# Altium project SoM BaseBoard Prototype V0.PrjPcb
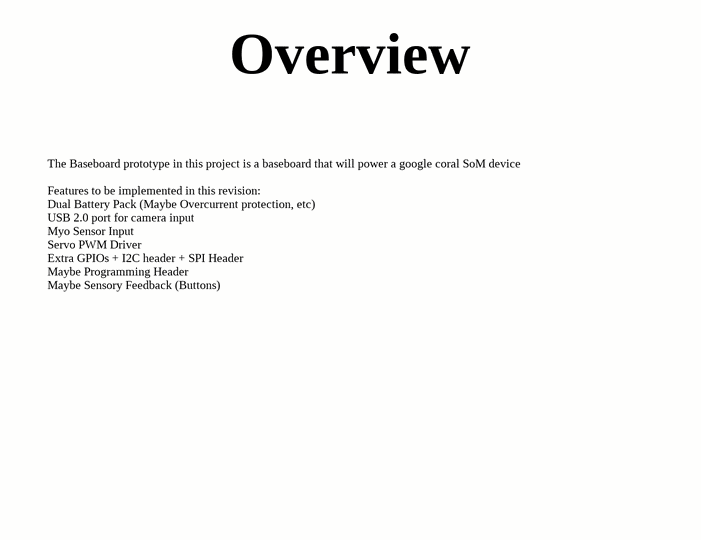
[diagram p0: Overview.SchDoc]
6 sheets, 82 parts. Net scope: flat (ports and power ports of the same name join across sheets).
Board file: SoM BaseBoard Limbotics Prototype V0PcbDoc.PcbDoc
Sheets:
  Overview.SchDoc
  SoM.SchDoc
  Power.SchDoc
  Peripherals - USB.SchDoc
  Peripherals - MyoSensor.SchDoc
  Peripherals - Servos.SchDoc

## Sheet Overview.SchDoc
size 420 x 297 mm; SheetNumber: 1; SheetTotal: 6

### Notes on the sheet
- Overview
- The Baseboard prototype in this project is a baseboard that will power a google coral SoM device
  Features to be implemented in this revision:
  Dual Battery Pack (Maybe Overcurrent protection, etc)
  USB 2.0 port for camera input
  Myo Sensor Input
  Servo PWM Driver
  Extra GPIOs + I2C header + SPI Header
  Maybe Programming Header
  Maybe Sensory Feedback (Buttons)
- THIS DOCUMENT AND THE DATA DISCLOSED HEREIN OR
- HEREWITH IS THE PROPERTY OF ALTIUM LIMITED AND MAY
- DWG NO:
- REVISION
- REV:
- DESCRIPTION
- DATE
- APPROVED
- BE FREELY DISTRIBUTED IN WHOLE. NO RIGHTS ARE
- RESERVED OR EXPRESS OR IMPLIED WARANTEE GIVEN.
- ENG:
- APPROVALS
- PROJECT
- DSN:
- CHK:
- REFERENCE DOCUMENTS
- PROJECT REVISION:
- TITLE
- DOCUMENT REVISION:
- DESIGN ITEM:
- BOM:
- FAB DWG:
- PCB DWG:
- ASSY DWG:
- SCALE:
- A3
- SIZE
- CAGE CODE
- FILE NAME
- DWG NO.
- SHEET
- OF
- REV

## Sheet SoM.SchDoc
size 420 x 297 mm; SheetNumber: 2; SheetTotal: 6
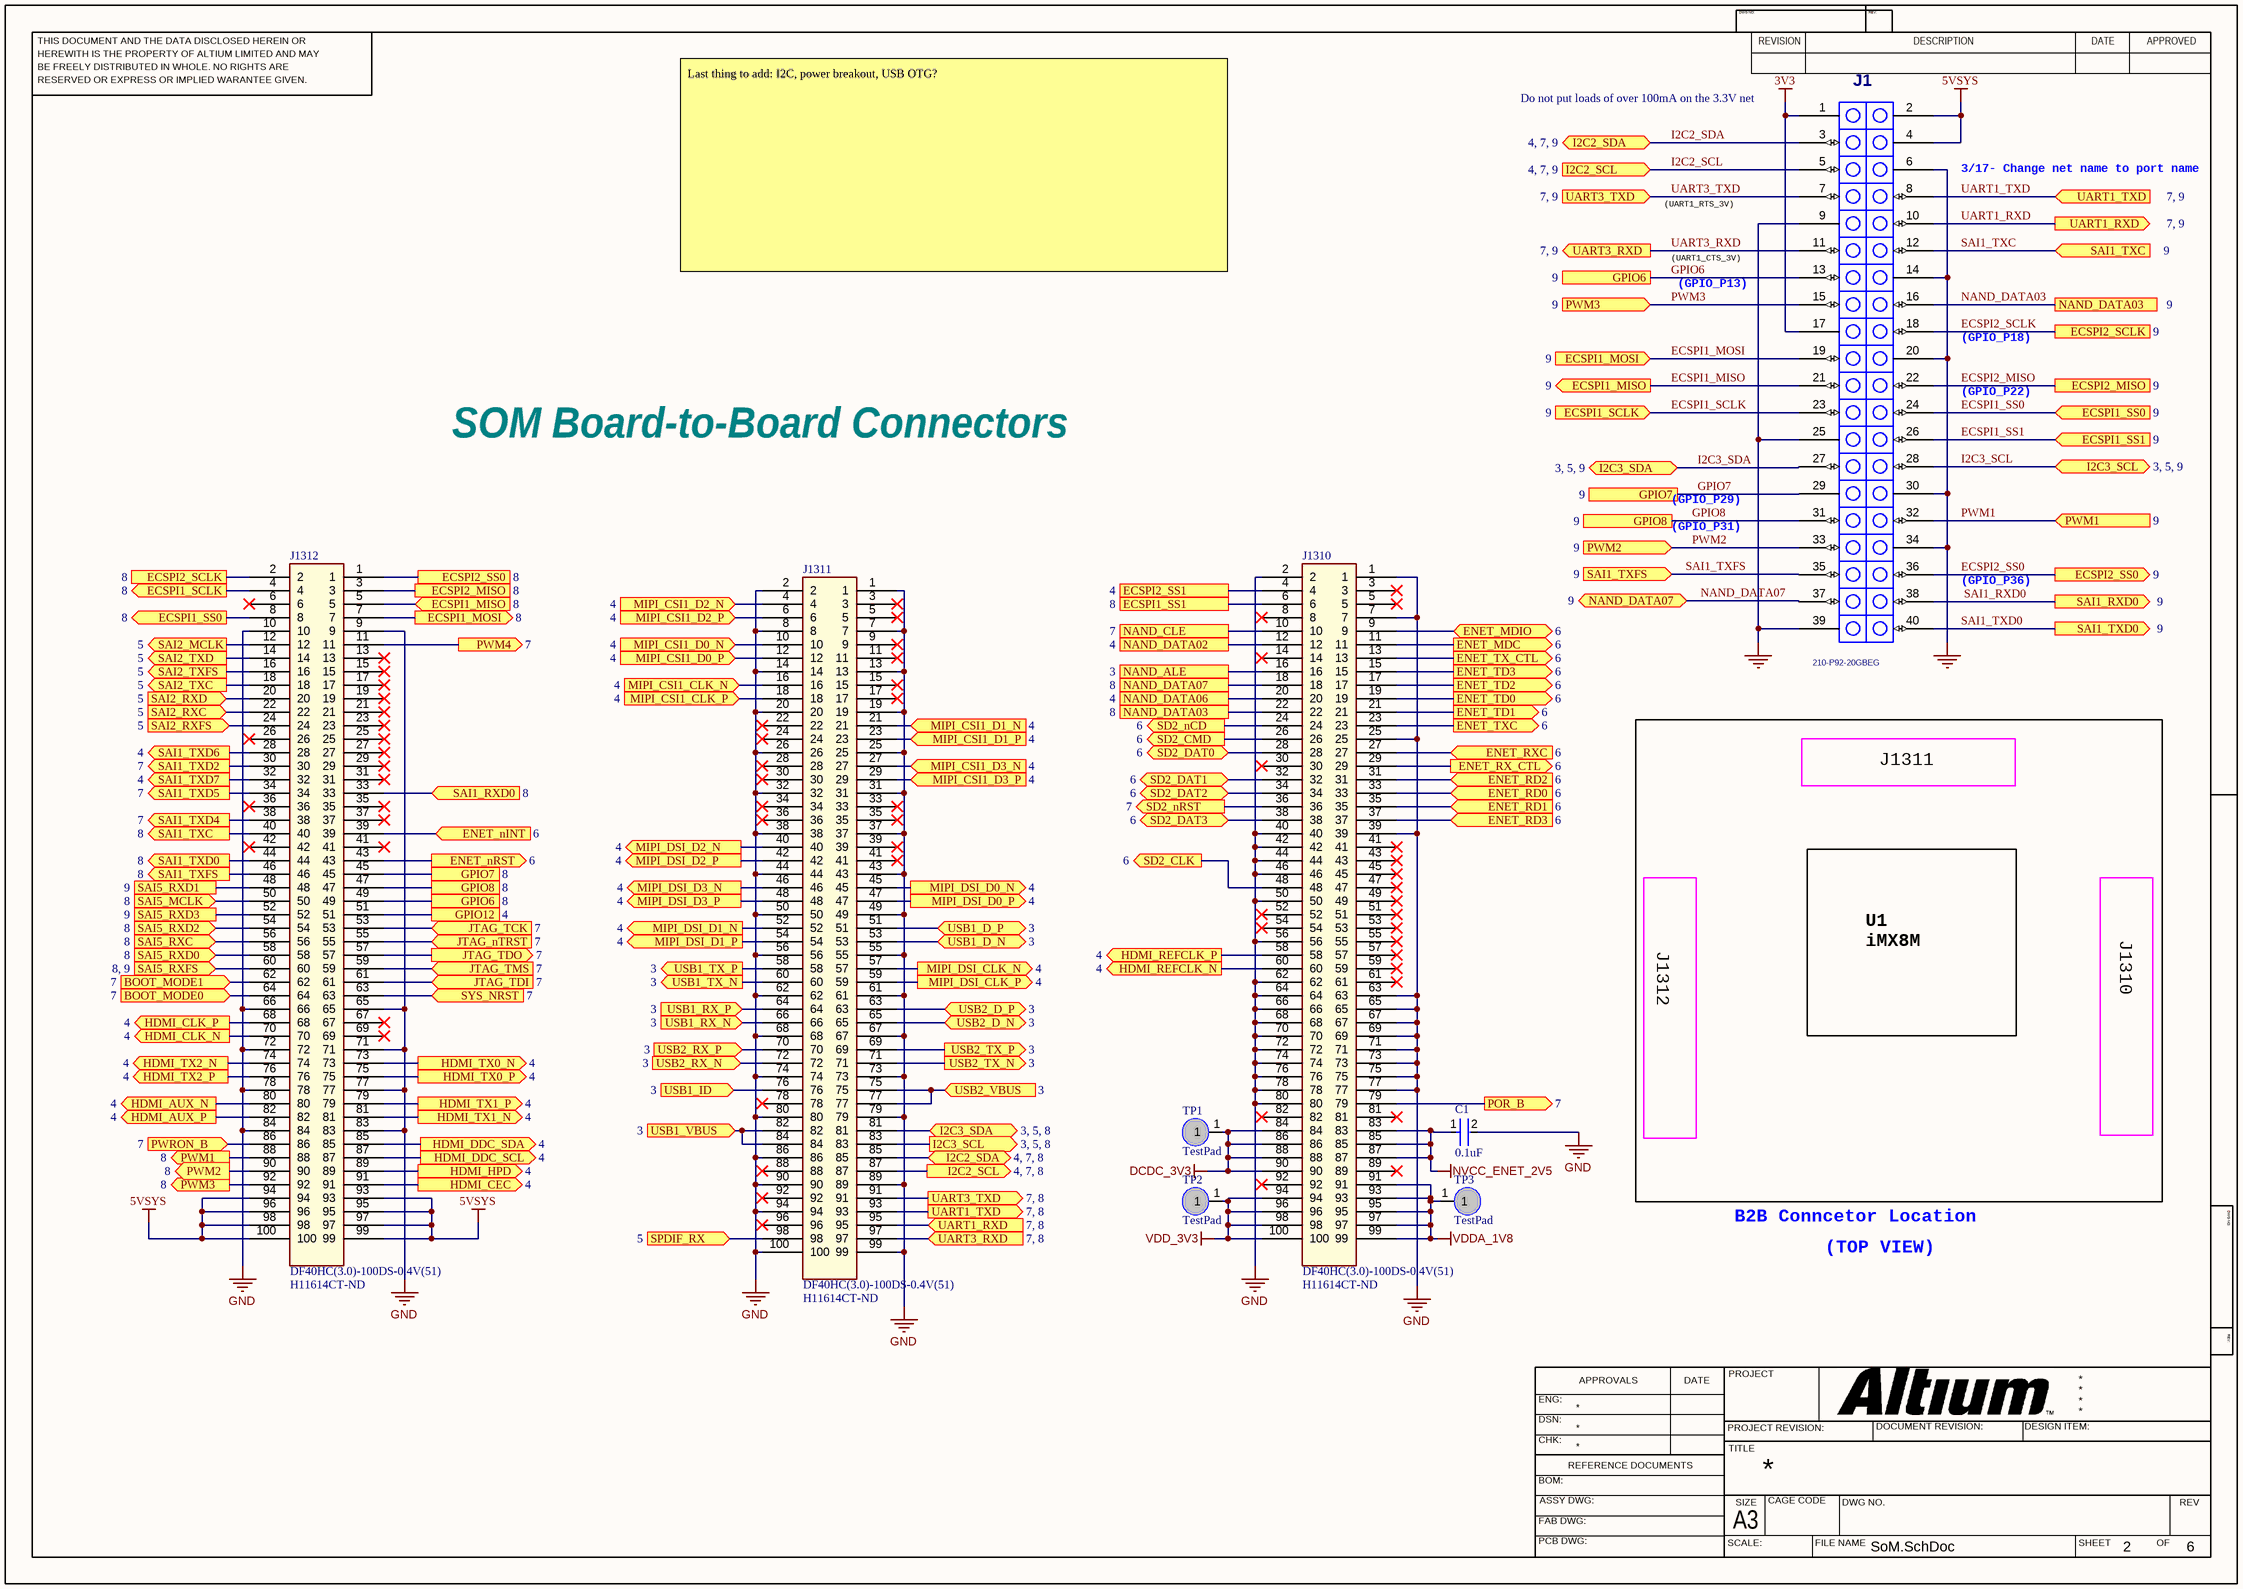
[diagram p1: SoM.SchDoc]

### Parts
C1  0.1uF  [FP-C0603-CJ-MFG]
J1  210-P92-20GBEG  [2X20]
J1310  DF40HC(3.0)-100DS-0.4V(51)  Supplier Part Number 1: H11614CT-ND  [DF40HC30100DS04V51]
J1311  DF40HC(3.0)-100DS-0.4V(51)  Supplier Part Number 1: H11614CT-ND  [DF40HC30100DS04V51]
J1312  DF40HC(3.0)-100DS-0.4V(51)  Supplier Part Number 1: H11614CT-ND  [DF40HC30100DS04V51]
TP1  TestPad  [TestPad50mil]
TP2  TestPad  [TestPad50mil]
TP3  TestPad  [TestPad50mil]

### Ports
BOOT_MODE0 (in, see 7), BOOT_MODE1 (in, see 7), ECSPI1_MISO (in, see 8), ECSPI1_MISO (out, see 9), ECSPI1_MOSI (in, see 9), ECSPI1_MOSI (out, see 8), ECSPI1_SCLK (in, see 9), ECSPI1_SCLK (out, see 8), ECSPI1_SS0 (in, see 9), ECSPI1_SS0 (out, see 8), ECSPI1_SS1 (in, see 9), ECSPI1_SS1 (see 8), ECSPI2_MISO (see 8), ECSPI2_MISO (see 9), ECSPI2_SCLK (see 8), ECSPI2_SCLK (see 9), ECSPI2_SS0 (out, see 9), ECSPI2_SS0 (see 8), ECSPI2_SS1 (see 4), ENET_MDC (out, see 6), ENET_MDIO (bidir, see 6), ENET_nINT (in, see 6), ENET_nRST (out, see 6), ENET_RD0 (in, see 6), ENET_RD1 (in, see 6), ENET_RD2 (in, see 6), ENET_RD3 (in, see 6), ENET_RX_CTL (out, see 6), ENET_RXC (in, see 6), ENET_TD0 (out, see 6), ENET_TD1 (out, see 6), ENET_TD2 (out, see 6), ENET_TD3 (out, see 6), ENET_TX_CTL (out, see 6), ENET_TXC (out, see 6), GPIO6 (see 8), GPIO6 (see 9), GPIO7 (see 8), GPIO7 (see 9), GPIO8 (see 8), GPIO8 (see 9), GPIO12 (see 4), HDMI_AUX_N (out, see 4), HDMI_AUX_P (out, see 4), HDMI_CEC (out, see 4), HDMI_CLK_N (out, see 4), HDMI_CLK_P (out, see 4), HDMI_DDC_SCL (out, see 4), HDMI_DDC_SDA (out, see 4), HDMI_HPD (out, see 4), HDMI_REFCLK_N (out, see 4), HDMI_REFCLK_P (out, see 4), HDMI_TX0_N (out, see 4), HDMI_TX0_P (out, see 4), HDMI_TX1_N (out, see 4), HDMI_TX1_P (out, see 4), HDMI_TX2_N (out, see 4), HDMI_TX2_P (out, see 4), I2C2_SCL (in, see 4, 7, 9), I2C2_SCL (out, see 4, 7, 8), I2C2_SDA (bidir, see 4, 7, 8), I2C2_SDA (bidir, see 4, 7, 9), I2C3_SCL (bidir, see 3, 5, 9), I2C3_SCL (out, see 3, 5, 8), I2C3_SDA (bidir, see 3, 5, 8), I2C3_SDA (bidir, see 3, 5, 9), JTAG_nTRST (in, see 7), JTAG_TCK (in, see 7), JTAG_TDI (in, see 7), JTAG_TDO (out, see 7), JTAG_TMS (in, see 7), MIPI_CSI1_CLK_N (in, see 4), MIPI_CSI1_CLK_P (in, see 4), MIPI_CSI1_D0_N (in, see 4), MIPI_CSI1_D0_P (in, see 4), MIPI_CSI1_D1_N (in, see 4), MIPI_CSI1_D1_P (in, see 4), MIPI_CSI1_D2_N (in, see 4), MIPI_CSI1_D2_P (in, see 4), MIPI_CSI1_D3_N (in, see 4), MIPI_CSI1_D3_P (in, see 4), MIPI_DSI_CLK_N (out, see 4), MIPI_DSI_CLK_P (out, see 4), MIPI_DSI_D0_N (out, see 4), MIPI_DSI_D0_P (out, see 4), MIPI_DSI_D1_N (out, see 4), MIPI_DSI_D1_P (out, see 4), MIPI_DSI_D2_N (out, see 4), MIPI_DSI_D2_P (out, see 4), MIPI_DSI_D3_N (out, see 4), MIPI_DSI_D3_P (out, see 4), NAND_ALE (see 3), NAND_CLE (see 7), NAND_DATA02 (see 4), NAND_DATA03 (see 8), NAND_DATA03 (see 9), NAND_DATA06 (see 4), NAND_DATA07 (bidir, see 9), NAND_DATA07 (see 8), POR_B (out, see 7), PWM1 (in, see 9), PWM1 (out, see 8), PWM2 (in, see 9), PWM2 (out, see 8), PWM3 (in, see 9), PWM3 (out, see 8), PWM4 (out, see 7), PWRON_B (in, see 7), SAI1_RXD0 (in, see 8), SAI1_RXD0 (out, see 9), SAI1_TXC (in, see 9), SAI1_TXC (out, see 8), SAI1_TXD0 (out, see 8), SAI1_TXD0 (out, see 9), SAI1_TXD2 (out, see 7), SAI1_TXD4 (out, see 7), SAI1_TXD5 (out, see 7), SAI1_TXD6 (out, see 4), SAI1_TXD7 (out, see 4), SAI1_TXFS (in, see 9), SAI1_TXFS (out, see 8), SAI2_MCLK (out, see 5), SAI2_RXC (in, see 5), SAI2_RXD (in, see 5), SAI2_RXFS (in, see 5), SAI2_TXC (out, see 5), SAI2_TXD (out, see 5), SAI2_TXFS (out, see 5), SAI5_MCLK (in, see 8), SAI5_RXC (in, see 8), SAI5_RXD0 (in, see 8), SAI5_RXD1 (see 9), SAI5_RXD2 (in, see 8), SAI5_RXD3 (see 9), SAI5_RXFS (in, see 8, 9), SD2_CLK (out, see 6), SD2_CMD (out, see 6), SD2_DAT0 (bidir, see 6), SD2_DAT1 (bidir, see 6), SD2_DAT2 (bidir, see 6), SD2_DAT3 (bidir, see 6), SD2_nCD (out, see 6), SD2_nRST (out, see 7), SPDIF_RX (in, see 5), SYS_NRST (in, see 7), UART1_RXD (in, see 7, 8), UART1_RXD (out, see 7, 9), UART1_TXD (in, see 7, 9), UART1_TXD (out, see 7, 8), UART3_RXD (in, see 7, 8), UART3_RXD (out, see 7, 9), UART3_TXD (in, see 7, 9), UART3_TXD (out, see 7, 8), USB1_D_N (bidir, see 3), USB1_D_P (bidir, see 3), USB1_ID (in, see 3), USB1_RX_N (in, see 3), USB1_RX_P (in, see 3), USB1_TX_N (out, see 3), USB1_TX_P (out, see 3), USB1_VBUS (in, see 3), USB2_D_N (bidir, see 3), USB2_D_P (bidir, see 3), USB2_RX_N (in, see 3), USB2_RX_P (in, see 3), USB2_TX_N (out, see 3), USB2_TX_P (out, see 3), USB2_VBUS (in, see 3)

### Nets
3V3: J1.1 J1.17
5VSYS: J1.2 J1.4 J1312.93 J1312.94 J1312.95 J1312.96 J1312.97 J1312.98 J1312.99 J1312.100
DCDC_3V3: J1310.84 J1310.86 J1310.88 J1310.90 TP1.1
GND: C1.2 J1.6 J1.9 J1.14 J1.20 J1.25 J1.30 J1.34 J1.39 J1310.1 J1310.2 J1310.7 J1310.25 J1310.39 J1310.40 J1310.42 J1310.44 J1310.46 J1310.50 J1310.56 J1310.62 J1310.63 J1310.64 J1310.65 J1310.66 J1310.67 J1310.68 J1310.69 J1310.70 J1310.71 J1310.72 J1310.73 J1310.74 J1310.75 J1310.76 J1310.77 J1310.78 J1310.80 J1311.1 J1311.2 J1311.7 J1311.8 J1311.13 J1311.14 J1311.19 J1311.20 J1311.25 J1311.26 J1311.31 J1311.32 J1311.37 J1311.38 J1311.43 J1311.44 J1311.49 J1311.50 J1311.55 J1311.56 J1311.61 J1311.62 J1311.67 J1311.68 J1311.73 J1311.74 J1311.79 J1311.80 J1311.86 J1311.89 J1311.90 J1311.94 J1311.99 J1311.100 J1312.9 J1312.10 J1312.65 J1312.66 J1312.71 J1312.72 J1312.77 J1312.78 J1312.83 J1312.84
NVCC_ENET_2V5: C1.1 J1310.83 J1310.85 J1310.87
VDD_3V3: J1310.94 J1310.96 J1310.98 J1310.100 TP2.1
VDDA_1V8: J1310.91 J1310.93 J1310.95 J1310.97 J1310.99 TP3.1
ECSPI1_MISO: J1.21 J1312.5 ; port ECSPI1_MISO
ECSPI1_MOSI: J1.19 J1312.7 ; port ECSPI1_MOSI
ECSPI1_SCLK: J1.23 J1312.4 ; port ECSPI1_SCLK
ECSPI1_SS0: J1.24 J1312.8 ; port ECSPI1_SS0
ECSPI1_SS1: J1.26 J1310.6 ; port ECSPI1_SS1
ECSPI2_MISO: J1.22 J1312.3 ; port ECSPI2_MISO
ECSPI2_SCLK: J1.18 J1312.2 ; port ECSPI2_SCLK
ECSPI2_SS0: J1.36 J1312.1 ; port ECSPI2_SS0
GPIO6: J1.13 J1312.49 ; port GPIO6
GPIO7: J1.29 J1312.45 ; port GPIO7
GPIO8: J1.31 J1312.47 ; port GPIO8
I2C2_SCL: J1.5 J1311.87 ; port I2C2_SCL
I2C2_SDA: J1.3 J1311.85 ; port I2C2_SDA
I2C3_SCL: J1.28 J1311.83 ; port I2C3_SCL
I2C3_SDA: J1.27 J1311.81 ; port I2C3_SDA
NAND_DATA03: J1.16 J1310.22 ; port NAND_DATA03
NAND_DATA07: J1.37 J1310.18 ; port NAND_DATA07
PWM1: J1.32 J1312.88 ; port PWM1
PWM2: J1.33 J1312.90 ; port PWM2
PWM3: J1.15 J1312.92 ; port PWM3
PWM4: J1312.11 ; port PWM4
SAI1_RXD0: J1.38 J1312.33 ; port SAI1_RXD0
SAI1_TXC: J1.12 J1312.40 ; port SAI1_TXC
SAI1_TXD0: J1.40 J1312.44 ; port SAI1_TXD0
SAI1_TXFS: J1.35 J1312.46 ; port SAI1_TXFS
UART1_RXD: J1.10 J1311.95 ; port UART1_RXD
UART1_TXD: J1.8 J1311.93 ; port UART1_TXD
UART3_RXD: J1.11 J1311.97 ; port UART3_RXD
UART3_TXD: J1.7 J1311.91 ; port UART3_TXD
NetJ4_2: J1311.65 ; port USB2_D_N
NetJ4_3: J1311.63 ; port USB2_D_P
NetJ1310_4: J1310.4 ; port ECSPI2_SS1
NetJ1310_9: J1310.9 ; port ENET_MDIO
NetJ1310_10: J1310.10 ; port NAND_CLE
NetJ1310_11: J1310.11 ; port ENET_MDC
NetJ1310_12: J1310.12 ; port NAND_DATA02
NetJ1310_13: J1310.13 ; port ENET_TX_CTL
NetJ1310_15: J1310.15 ; port ENET_TD3
NetJ1310_16: J1310.16 ; port NAND_ALE
NetJ1310_17: J1310.17 ; port ENET_TD2
NetJ1310_19: J1310.19 ; port ENET_TD0
NetJ1310_20: J1310.20 ; port NAND_DATA06
NetJ1310_21: J1310.21 ; port ENET_TD1
NetJ1310_23: J1310.23 ; port ENET_TXC
NetJ1310_24: J1310.24 ; port SD2_nCD
NetJ1310_26: J1310.26 ; port SD2_CMD
NetJ1310_27: J1310.27 ; port ENET_RXC
NetJ1310_28: J1310.28 ; port SD2_DAT0
NetJ1310_29: J1310.29 ; port ENET_RX_CTL
NetJ1310_31: J1310.31 ; port ENET_RD2
NetJ1310_32: J1310.32 ; port SD2_DAT1
NetJ1310_33: J1310.33 ; port ENET_RD0
NetJ1310_34: J1310.34 ; port SD2_DAT2
NetJ1310_35: J1310.35 ; port ENET_RD1
NetJ1310_36: J1310.36 ; port SD2_nRST
NetJ1310_37: J1310.37 ; port ENET_RD3
NetJ1310_38: J1310.38 ; port SD2_DAT3
NetJ1310_48: J1310.48 ; port SD2_CLK
NetJ1310_58: J1310.58 ; port HDMI_REFCLK_P
NetJ1310_60: J1310.60 ; port HDMI_REFCLK_N
NetJ1310_79: J1310.79 ; port POR_B
NetJ1311_4: J1311.4 ; port MIPI_CSI1_D2_N
NetJ1311_6: J1311.6 ; port MIPI_CSI1_D2_P
NetJ1311_10: J1311.10 ; port MIPI_CSI1_D0_N
NetJ1311_12: J1311.12 ; port MIPI_CSI1_D0_P
NetJ1311_16: J1311.16 ; port MIPI_CSI1_CLK_N
NetJ1311_18: J1311.18 ; port MIPI_CSI1_CLK_P
NetJ1311_21: J1311.21 ; port MIPI_CSI1_D1_N
NetJ1311_23: J1311.23 ; port MIPI_CSI1_D1_P
NetJ1311_27: J1311.27 ; port MIPI_CSI1_D3_N
NetJ1311_29: J1311.29 ; port MIPI_CSI1_D3_P
NetJ1311_40: J1311.40 ; port MIPI_DSI_D2_N
NetJ1311_42: J1311.42 ; port MIPI_DSI_D2_P
NetJ1311_45: J1311.45 ; port MIPI_DSI_D0_N
NetJ1311_46: J1311.46 ; port MIPI_DSI_D3_N
NetJ1311_47: J1311.47 ; port MIPI_DSI_D0_P
NetJ1311_48: J1311.48 ; port MIPI_DSI_D3_P
NetJ1311_51: J1311.51 ; port USB1_D_P
NetJ1311_52: J1311.52 ; port MIPI_DSI_D1_N
NetJ1311_53: J1311.53 ; port USB1_D_N
NetJ1311_54: J1311.54 ; port MIPI_DSI_D1_P
NetJ1311_57: J1311.57 ; port MIPI_DSI_CLK_N
NetJ1311_58: J1311.58 ; port USB1_TX_P
NetJ1311_59: J1311.59 ; port MIPI_DSI_CLK_P
NetJ1311_60: J1311.60 ; port USB1_TX_N
NetJ1311_64: J1311.64 ; port USB1_RX_P
NetJ1311_66: J1311.66 ; port USB1_RX_N
NetJ1311_69: J1311.69 ; port USB2_TX_P
NetJ1311_70: J1311.70 ; port USB2_RX_P
NetJ1311_71: J1311.71 ; port USB2_TX_N
NetJ1311_72: J1311.72 ; port USB2_RX_N
NetJ1311_75: J1311.75 J1311.77 ; port USB2_VBUS
NetJ1311_76: J1311.76 ; port USB1_ID
NetJ1311_82: J1311.82 J1311.84 ; port USB1_VBUS
NetJ1311_98: J1311.98 ; port SPDIF_RX
NetJ1312_12: J1312.12 ; port SAI2_MCLK
NetJ1312_14: J1312.14 ; port SAI2_TXD
NetJ1312_16: J1312.16 ; port SAI2_TXFS
NetJ1312_18: J1312.18 ; port SAI2_TXC
NetJ1312_20: J1312.20 ; port SAI2_RXD
NetJ1312_22: J1312.22 ; port SAI2_RXC
NetJ1312_24: J1312.24 ; port SAI2_RXFS
NetJ1312_28: J1312.28 ; port SAI1_TXD6
NetJ1312_30: J1312.30 ; port SAI1_TXD2
NetJ1312_32: J1312.32 ; port SAI1_TXD7
NetJ1312_34: J1312.34 ; port SAI1_TXD5
NetJ1312_38: J1312.38 ; port SAI1_TXD4
NetJ1312_39: J1312.39 ; port ENET_nINT
NetJ1312_43: J1312.43 ; port ENET_nRST
NetJ1312_48: J1312.48 ; port SAI5_RXD1
NetJ1312_50: J1312.50 ; port SAI5_MCLK
NetJ1312_51: J1312.51 ; port GPIO12
NetJ1312_52: J1312.52 ; port SAI5_RXD3
NetJ1312_53: J1312.53 ; port JTAG_TCK
NetJ1312_54: J1312.54 ; port SAI5_RXD2
NetJ1312_55: J1312.55 ; port JTAG_nTRST
NetJ1312_56: J1312.56 ; port SAI5_RXC
NetJ1312_57: J1312.57 ; port JTAG_TDO
NetJ1312_58: J1312.58 ; port SAI5_RXD0
NetJ1312_59: J1312.59 ; port JTAG_TMS
NetJ1312_60: J1312.60 ; port SAI5_RXFS
NetJ1312_61: J1312.61 ; port JTAG_TDI
NetJ1312_62: J1312.62 ; port BOOT_MODE1
NetJ1312_63: J1312.63 ; port SYS_NRST
NetJ1312_64: J1312.64 ; port BOOT_MODE0
NetJ1312_68: J1312.68 ; port HDMI_CLK_P
NetJ1312_70: J1312.70 ; port HDMI_CLK_N
NetJ1312_73: J1312.73 ; port HDMI_TX0_N
NetJ1312_74: J1312.74 ; port HDMI_TX2_N
NetJ1312_75: J1312.75 ; port HDMI_TX0_P
NetJ1312_76: J1312.76 ; port HDMI_TX2_P
NetJ1312_79: J1312.79 ; port HDMI_TX1_P
NetJ1312_80: J1312.80 ; port HDMI_AUX_N
NetJ1312_81: J1312.81 ; port HDMI_TX1_N
NetJ1312_82: J1312.82 ; port HDMI_AUX_P
NetJ1312_85: J1312.85 ; port HDMI_DDC_SDA
NetJ1312_86: J1312.86 ; port PWRON_B
NetJ1312_87: J1312.87 ; port HDMI_DDC_SCL
NetJ1312_89: J1312.89 ; port HDMI_HPD
NetJ1312_91: J1312.91 ; port HDMI_CEC

Not connected (* = marked no-connect by the designer): J1310 3* 5* 8* 14* 30* 41* 43* 45* 47* 49* 51* 52* 53* 54* 55* 57* 59* 61* 81* 82* 89* 92*; J1311 3* 5* 9* 11* 15* 17* 22* 24* 28* 30* 33* 34* 35* 36* 39* 41* 78* 88* 92* 96*; J1312 6* 13* 15* 17* 19* 21* 23* 25* 26* 27* 29* 31* 35* 36* 37* 41* 42* 67* 69*

### Notes on the sheet
- (near J1) Do not put loads of over 100mA on the 3.3V net
- 3/17- Change net name to port name
- (UART1_RTS_3V)
- (UART1_CTS_3V)
- Last thing to add: I2C, power breakout, USB OTG?
- (GPIO_P13)
- (GPIO_P18)
- (GPIO_P22)
- SOM Board-to-Board Connectors
- (GPIO_P31)
- (GPIO_P29)
- (GPIO_P36)
- J1311
- J1310
- J1312
- U1
  iMX8M
- B2B Conncetor Location
- (TOP VIEW)
- THIS DOCUMENT AND THE DATA DISCLOSED HEREIN OR
- HEREWITH IS THE PROPERTY OF ALTIUM LIMITED AND MAY
- DWG NO:
- REVISION
- REV:
- DESCRIPTION
- DATE
- APPROVED
- BE FREELY DISTRIBUTED IN WHOLE. NO RIGHTS ARE
- RESERVED OR EXPRESS OR IMPLIED WARANTEE GIVEN.
- ENG:
- APPROVALS
- PROJECT
- DSN:
- CHK:
- REFERENCE DOCUMENTS
- PROJECT REVISION:
- TITLE
- DOCUMENT REVISION:
- DESIGN ITEM:
- BOM:
- FAB DWG:
- PCB DWG:
- ASSY DWG:
- SCALE:
- A3
- SIZE
- CAGE CODE
- FILE NAME
- DWG NO.
- SHEET
- OF
- REV

### Library data of the parts
C1 = CMP-2006-03300-2: C0603X104K5RACTU CAP CER 0.1UF 50V X7R 0603; Manufacturer: Kemet; Description: Ceramic Chip Capacitor 0.1µF ±10% 50V; Capacitance: 100nF; Material: Ceramic; Tolerance: 10%; Value: 100nF; Temperature Coefficient: 15%; Temperature Range High: +125°C; Temperature Range Low: -55°C; Manufacturer Part Number: C0603X104K5RACTU; Voltage: 50V; ComponentLink2Description: Datasheet; RoHS: TRUE; ComponentLink2URL: https://content.kemet.com/datasheets/KEM_C1013_X7R_FT-CAP_SMD.pdf; Device Class L3: Ceramic Capacitors; Device Class L2: Capacitors; Package: C0603-CJ; Height: 0.95mm; Device Class L1: Passive Components; Temperature Characteristic: X7R; Lead Free: Yes; Digikey Description: CAP CER 0.1UF 50V X7R 0603; Automotive: No; Mouser Description: Capacitor; Ceramic; Cap 0.1uF; Tol+10%; SMT; Flexible Termination; Vol-Rtg 50V; TR; Temperature: -55°C to +125°C; Octopart: https://octopart.com/c0603x104k5ractu-kemet-9145062; Category: Cap; Voltage Rating: 50V; Ipc Land Pattern Name: CAPC16080X80
J1 = CONN_HEADER_20x2_SMT: SOCKET 2X20 100-MIL STRAIGHT SMT; Function Code: DOK; QPN: DFHD20MS161; QPN Description: CONN DIP HEADER 20P 2R MS(P2.54,H8.3); Supplier 1: Samtec; Supplier Part Number 1: 210-P92-20GBEG; MPN: 210-P92-20GBEG; QCI MPN: 210-P92-20GBEG; QCI Supplier: PRX
J1310-J1312 = CONN_HIROSE-DF40C-100DP-0.4V(51): CONN HDR 100POS 0.4MM SMD GOLD; Function Code: DOK; QPN: DFHSA0FR017; QPN Description: CONN HOUSING 100P 2R FR(P0.4,H2.9); QCI Supplier: HRS; Supplier 1: Digi-Key; MPN: DF40HC(3.0)-100DS-0.4V(51); QCI MPN: DF40HC(3.0)-100DS-0.4V(51)

## Sheet Power.SchDoc
size 420 x 297 mm; SheetNumber: 3; SheetTotal: 6
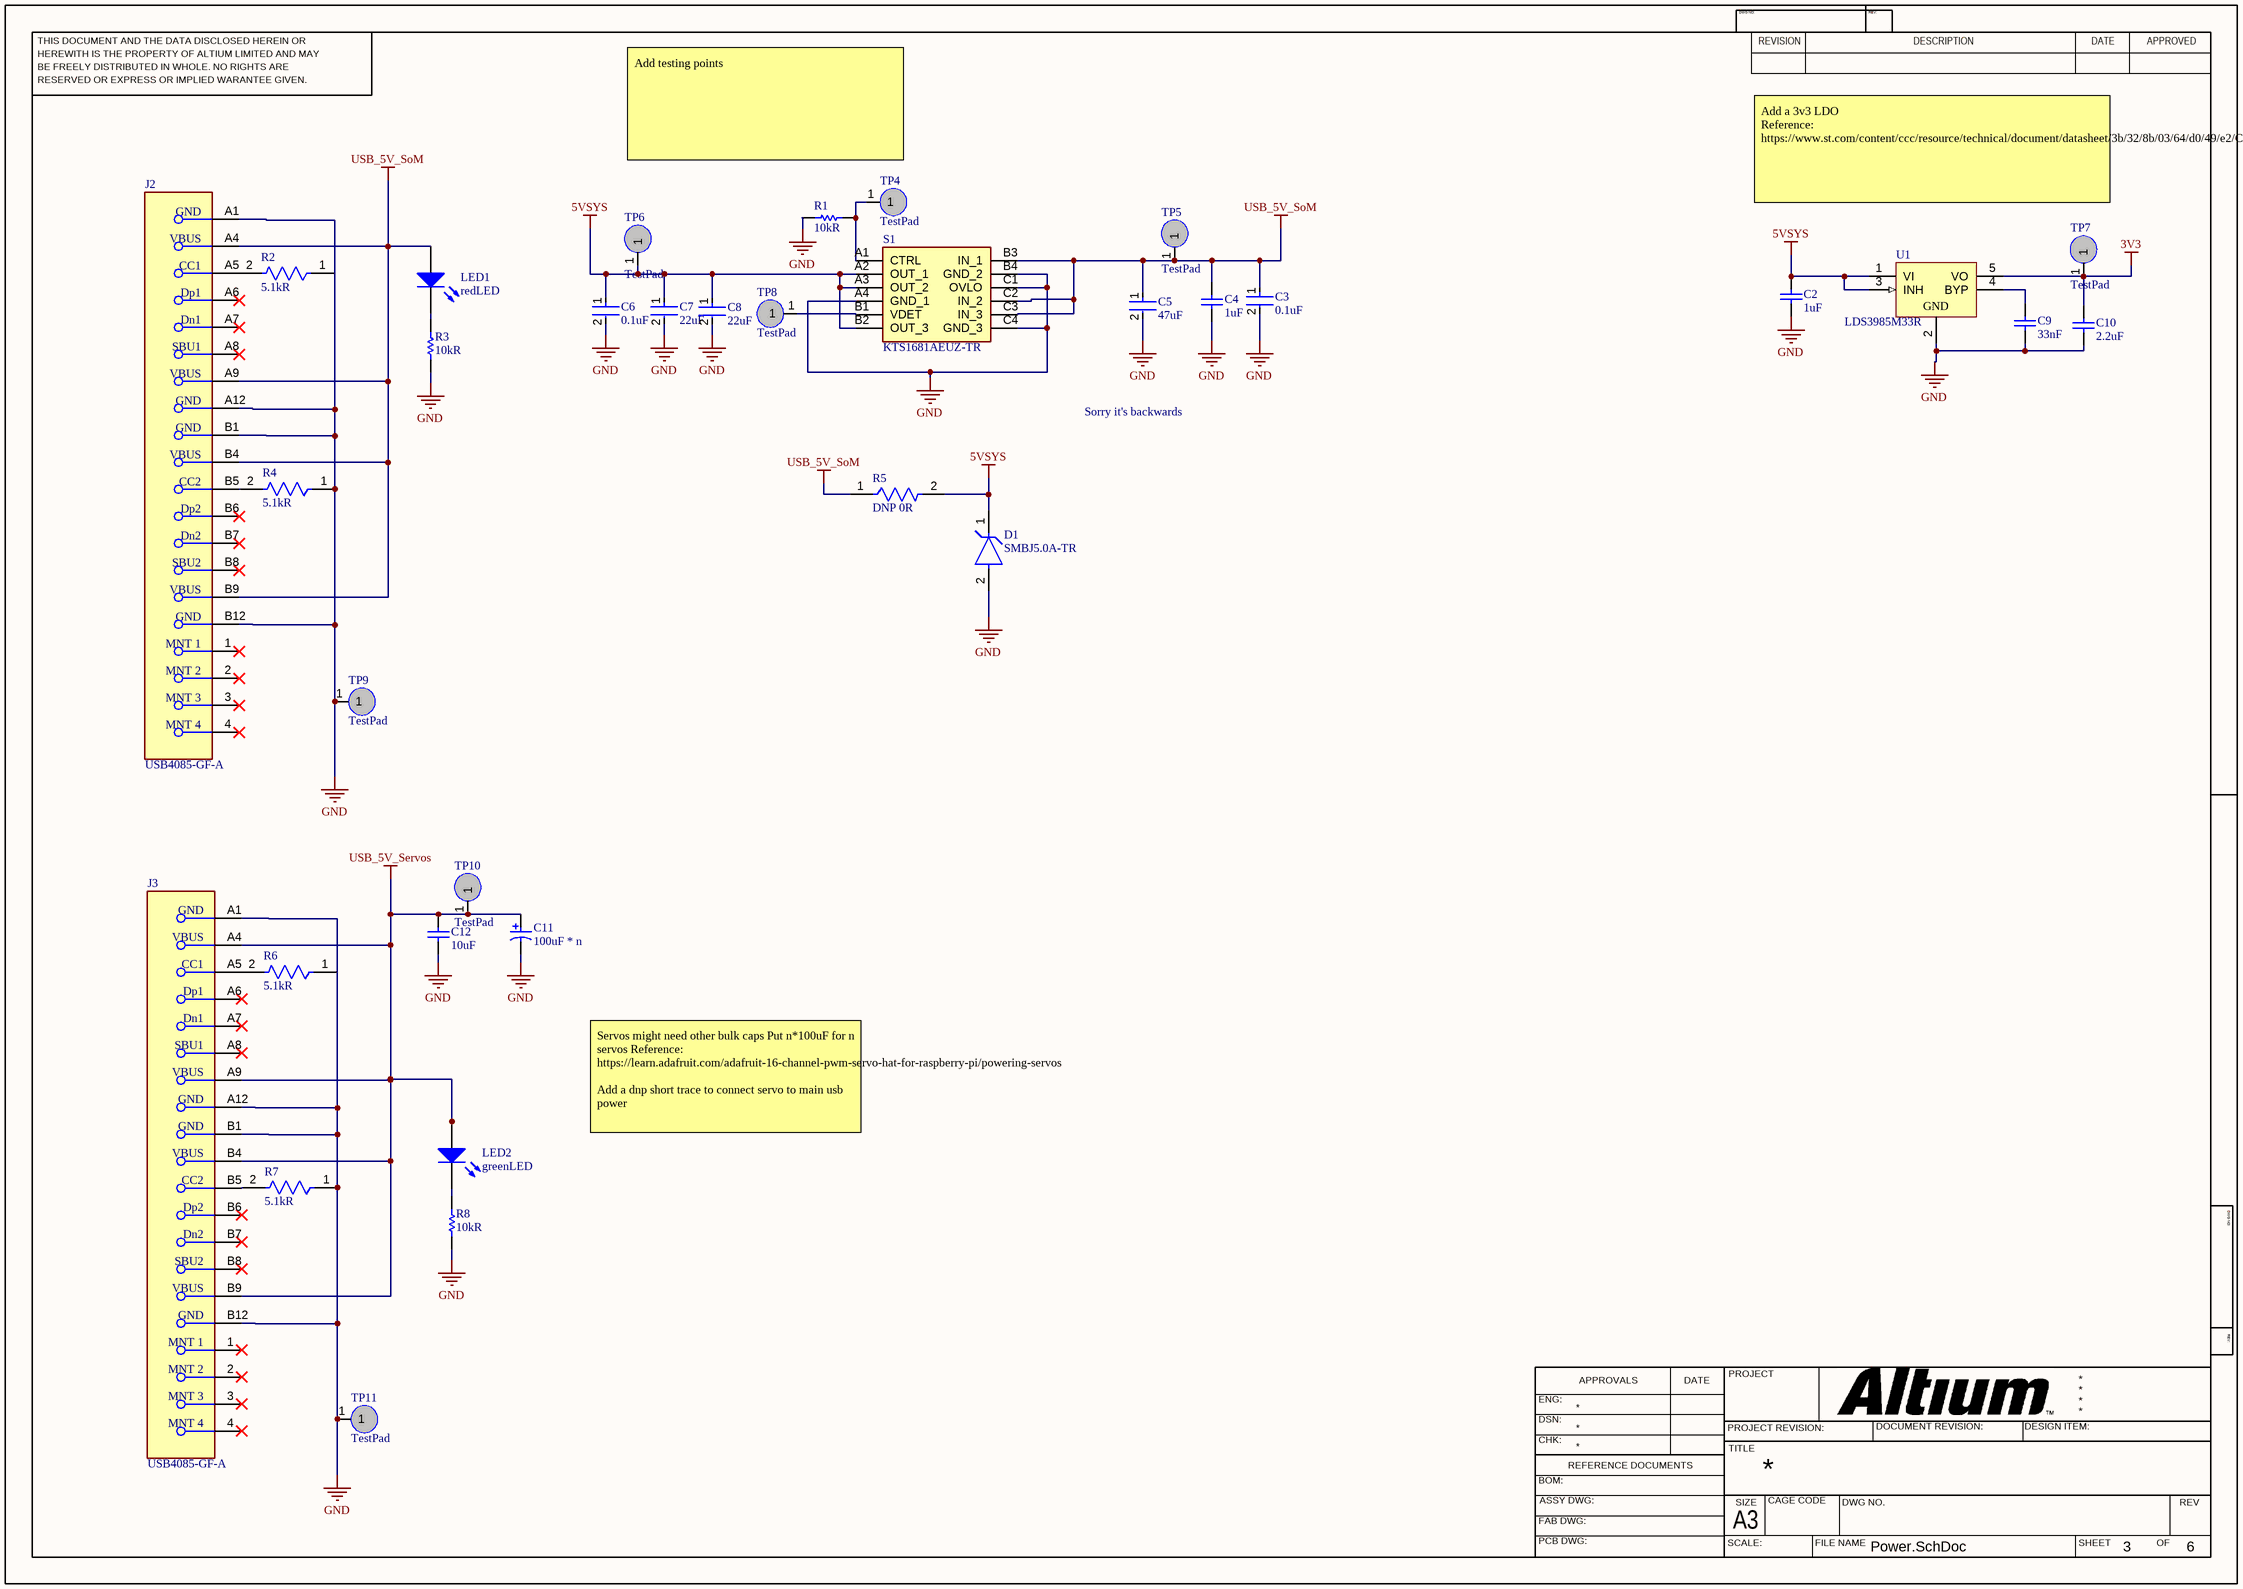
[diagram p2: Power.SchDoc]

### Parts
C2  1uF  [CAPC2013X145X50LL20T25]
C3  0.1uF  [FP-C0603-CJ-MFG]
C4  1uF  [CAPC2013X145X50LL20T25]
C5  47uF  [FP-GRM31C-0_2-e0_3_0_8-IPC_C]
C6  0.1uF  [FP-C0603-CJ-MFG]
C7  22uF  [FP-GRM21B-0_15-MFG]
C8  22uF  [FP-GRM21B-0_15-MFG]
C9  33nF  [CAPC2013X94X50LL20T25]
C10  2.2uF  [CAPC2013X135X50ML10T20]
C11  100uF * n  [CAPPR65-500-2000X1250X2200]
C12  10uF  [CAPC2013X145X20ML20]
D1  SMBJ5.0A-TR  [FP-SMB-MFG]
J2  USB4085-GF-A  [FP-USB4085-GF-A-MFG]
J3  USB4085-GF-A  [FP-USB4085-GF-A-MFG]
LED1  redLED  [0805_A]
LED2  greenLED  [0805_A]
R1  10kR  [RESC2013X60X35NL10T20]
R2  5.1kR  [FP-CRCW0805-e3-MFG]
R3  10kR  [RESC2013X60X35ML10T20]
R4  5.1kR  [FP-CRCW0805-e3-MFG]
R5  DNP 0R  [FP-RC1206-MFG]
R6  5.1kR  [FP-CRCW0805-e3-MFG]
R7  5.1kR  [FP-CRCW0805-e3-MFG]
R8  10kR  [RESC2013X60X35ML10T20]
S1  KTS1681AEUZ-TR  [KTS1681AEUZTR]
TP4  TestPad  [TestPad50mil]
TP5  TestPad  [TestPad50mil]
TP6  TestPad  [TestPad50mil]
TP7  TestPad  [TestPad50mil]
TP8  TestPad  [TestPad50mil]
TP9  TestPad  [TestPad50mil]
TP10  TestPad  [TestPad50mil]
TP11  TestPad  [TestPad50mil]
U1  LDS3985M33R  [SOT23-5L_M]

### Nets
3V3: C10.2 TP7.1 U1.5(VO)
5VSYS: C2.2 C6.1 C7.1 C8.1 D1.1(K) R5.2 S1.A2(OUT_1) S1.A3(OUT_2) S1.B2(OUT_3) TP6.1 U1.1(VI) U1.3(INH)
GND: C2.1 C3.2 C4.1 C5.2 C6.2 C7.2 C8.2 C9.1 C10.1 C11.2 C12.1 D1.2(A) J2.A1(GND) J2.A12(GND) J2.B1(GND) J2.B12(GND) J3.A1(GND) J3.A12(GND) J3.B1(GND) J3.B12(GND) R1.2 R3.1 R4.1 R7.1 R8.1 S1.A4(GND_1) S1.B4(GND_2) S1.C1(OVLO) S1.C4(GND_3) TP9.1 TP11.1 U1.2(GND)
USB_5V_Servos: C11.1 C12.2 J3.A4(VBUS) J3.A9(VBUS) J3.B4(VBUS) J3.B9(VBUS) LED2.2(A) TP10.1
USB_5V_SoM: C3.1 C4.2 C5.1 J2.A4(VBUS) J2.A9(VBUS) J2.B4(VBUS) J2.B9(VBUS) LED1.2(A) R5.1 S1.B3(IN_1) S1.C2(IN_2) S1.C3(IN_3) TP5.1
NetC9_2: C9.2 U1.4(BYP)
NetJ2_A5: J2.A5(CC1) R2.2
NetJ2_B5: J2.B5(CC2) R4.2
NetJ3_A5: J3.A5(CC1) R6.2
NetJ3_B5: J3.B5(CC2) R7.2
NetLED1_1: LED1.1(K) R3.2
NetLED2_1: LED2.1(K) R8.2
NetR1_1: R1.1 S1.A1(CTRL) TP4.1
NetS1_B1: S1.B1(VDET) TP8.1

Not connected (* = marked no-connect by the designer): J2 1(MNT_1)* 2(MNT_2)* 3(MNT_3)* 4(MNT_4)* A6(Dp1)* A7(Dn1)* A8(SBU1)* B6(Dp2)* B7(Dn2)* B8(SBU2)*; J3 1(MNT_1)* 2(MNT_2)* 3(MNT_3)* 4(MNT_4)* A6(Dp1)* A7(Dn1)* A8(SBU1)* B6(Dp2)* B7(Dn2)* B8(SBU2)*; R2 1; R6 1

### Notes on the sheet
- Add testing points
- Add a 3v3 LDO
  Reference: https://www.st.com/content/ccc/resource/technical/document/datasheet/3b/32/8b/03/64/d0/49/e2/CD00047465.pdf/files/CD00047465.pdf/jcr:content/translations/en.CD00047465.pdf
- Sorry it's backwards
- Servos might need other bulk caps Put n*100uF for n servos Reference:
  https://learn.adafruit.com/adafruit-16-channel-pwm-servo-hat-for-raspberry-pi/powering-servos
  Add a dnp short trace to connect servo to main usb power
- THIS DOCUMENT AND THE DATA DISCLOSED HEREIN OR
- HEREWITH IS THE PROPERTY OF ALTIUM LIMITED AND MAY
- DWG NO:
- REVISION
- REV:
- DESCRIPTION
- DATE
- APPROVED
- BE FREELY DISTRIBUTED IN WHOLE. NO RIGHTS ARE
- RESERVED OR EXPRESS OR IMPLIED WARANTEE GIVEN.
- ENG:
- APPROVALS
- PROJECT
- DSN:
- CHK:
- REFERENCE DOCUMENTS
- PROJECT REVISION:
- TITLE
- DOCUMENT REVISION:
- DESIGN ITEM:
- BOM:
- FAB DWG:
- PCB DWG:
- ASSY DWG:
- SCALE:
- A3
- SIZE
- CAGE CODE
- FILE NAME
- DWG NO.
- SHEET
- OF
- REV

### Library data of the parts
C2 C4 = CMP-1036-04746-2: C0805C105K4PACTU; Manufacturer: Kemet; Part Number: C0805C105K4PACTU
C3 C6 = CMP-2006-03300-2: C0603X104K5RACTU CAP CER 0.1UF 50V X7R 0603; Manufacturer: Kemet; Capacitance: 100nF; Material: Ceramic; Tolerance: 10%; Value: 100nF; Temperature Coefficient: 15%; Temperature Range High: +125°C; Temperature Range Low: -55°C; Manufacturer Part Number: C0603X104K5RACTU; Voltage: 50V; ComponentLink2Description: Datasheet; RoHS: TRUE; ComponentLink2URL: https://content.kemet.com/datasheets/KEM_C1013_X7R_FT-CAP_SMD.pdf; Device Class L3: Ceramic Capacitors; Device Class L2: Capacitors; Package: C0603-CJ; Height: 0.95mm; Device Class L1: Passive Components; Temperature Characteristic: X7R; Lead Free: Yes; Digikey Description: CAP CER 0.1UF 50V X7R 0603; Automotive: No; Mouser Description: Capacitor; Ceramic; Cap 0.1uF; Tol+10%; SMT; Flexible Termination; Vol-Rtg 50V; TR; Temperature: -55°C to +125°C; Octopart: https://octopart.com/c0603x104k5ractu-kemet-9145062; Category: Cap; Voltage Rating: 50V; Ipc Land Pattern Name: CAPC16080X80
C5 = CMP-2000-06344-2: GRM31CR60J476ME19L Chip Multilayer Ceramic Capacitors for General Purpose, 1206, 47uF, X5R, 15%, 20%, 6.3V; Package Quantity: 2000; Mount: Surface Mount; Length: 3.2mm; Thickness: 0.071inch; Lead Free: Lead Free; Tolerance: 20%; Width: 0.063inch; Depth: 1.6mm; Case/Package: 1206; Dielectric: X5R; Radiation Hardening: No; Packaging: Tape and Reel; Voltage Rating (DC): 6.3V; Termination: SMD/SMT; Height: 1.6mm; Max Operating Temperature: 85°C; Case Code (Metric): 3216; Case Code (Imperial): 1206; Voltage: 6.3V; Voltage Rating: 6.3V; Capacitance: 47uF; Min Operating Temperature: -55°C; Material: Ceramic; REACH SVHC: No SVHC
C7 C8 = CMP-2007-03385-2: GRM21BR60J226ME39L Chip Multilayer Ceramic Capacitors for General Purpose, 0805, 22uF, X5R, 15%, 20%, 6.3V; Material: Ceramic; Max Operating Temperature: 85°C; Voltage: 6.3V; Min Operating Temperature: -55°C; Case/Package: 0805; Thickness: 0.053inch; Dielectric: X5R; Packaging: Tape and Reel; Depth: 1.25mm; Termination: SMD/SMT; Voltage Rating (DC): 6.3V; Radiation Hardening: No; Tolerance: 20%; Mount: Surface Mount; Lead Free: Lead Free; Package Quantity: 1; REACH SVHC: No SVHC; Voltage Rating: 6.3V; Capacitance: 22uF; Length: 2mm; Case Code (Imperial): 0805; Case Code (Metric): 2012; Width: 0.049inch; Height: 1.25mm
C9 = CMP-1036-04167-2: 08055C333JAT2A; Manufacturer: AVX Interconnect / Elco; Part Number: 08055C333JAT2A
C10 = CMP-2007-03455-1: GRM21BR71C225KA12L; Manufacturer: Murata; Part Number: GRM21BR71C225KA12L
C11 = CMP-1665-00014-4: ECA-1JHG471 Aluminum Electrolytic Capacitor (Radial Lead Type), 470 uF, 63 V, -55 to 105 degC, 2-Pin THD, RoHS, Bulk; Manufacturer: Panasonic; Voltage Rating: 63 V; Lead Pitch: 5 mm; ComponentLink2URL: http://industrial.panasonic.com/cdbs/www-data/pdf/RDF0000/ABA0000C1038.pdf; DatasheetVersion: 03/2016; ComponentLink1URL: http://www.panasonic.com/; Mount: Through Hole; Max Operating Temperature: 105 degC; Pins: 2; Packaging: Bulk; ComponentLink1Description: Manufacturer URL; Height: 20 mm; REACH SVHC: No SVHC; RoHSCompliant: true; Mounting Technology: Through Hole; PackageDescription: 2-Pin Through Hole Device, Dia 12.5 mm, Body Length 20 mm; Package Quantity: 200; Min Operating Temperature: -55 degC; PackageReference: Radial; ComponentLink2Description: Datasheet; Length: 20 mm
C12 = CMP-2000-05452-1: C2012X7R1A106K125AC Multilayer Ceramic Chip Capacitor, 10 uF, +/- 10%, 10 V, -55 to 125 degC, 0805 (2012 Metric), RoHS, Tape and Reel; Manufacturer: TDK; PCN Part Number: MLCCPartNumberChange30/Nov/2012; Capacitance: 10µF; Voltage - Rated: 10V; Product Training Modules: CSeriesGeneralApplicationsSEAT,CCV,andTVCLDesignToolsGuidetoReplacinganElectrolyticCapacitorwithanMLCC; Online Catalog: CSeries,GeneralPurpose; Other Names: 445-6857-6; Temperature Coefficient: X7R; Features: -; Ratings: -; Operating Temperature: -55degC~125degC; RoHS Information: RoHSCertificate-MLCC; Datasheet Version: Mar-15; Package / Case: 0805(2012Metric); Series: C; Mounting Type: SurfaceMount,MLCC; Family: CeramicCapacitors; Height - Seated (Max): -; Manufacturer URL: http://www.tdk.com/; Packaging: Digi-Reel; Tolerance: ±10%; Category: Capacitors; Applications: GeneralPurpose; Standard Package: 1; Size / Dimension: 0.079"Lx0.049"W(2.00mmx1.25mm); Datasheet URL: http://download.siliconexpert.com/pdfs/2015/4/21/15/54/45/779/tdk_/manual/37024850441143360mlcc_commercial_general_en.pdf; Lead Style: -; Lead Spacing: -; Thickness (Max): 0.057"(1.45mm); Package Reference: 805; Package Description: 2-Pin Surface Mount Device, Body 2 x 1.25 mm
D1 = CMP-12225-000019-1: TVS DIODE 5V 13.4V SMB; Manufacturer: STMicroelectronics; Number Of Channels: 1; Peak Pulse Power: 600W; Clamping Voltage: 14.4V; Standoff Height: 0.05mm; Peak Pulse Current: 275A; Max Junction Temp: +150°C; Direction: Unidirectional; Breakdown Voltage: 6.4V; Device Class L3: unset; Mouser Description: SMBJ Series 600 W 5 V Uni Directional SMT TVS Diode - DO-214AA; Automotive: No; Lead Free: Yes; ComponentLink2URL: https://www.st.com/resource/en/datasheet/smbj.pdf; Package: SMB; Reverse Standoff Voltage: 5V; Device Class L1: Circuit Protection; RoHS: TRUE; Temperature Range Low: -55°C; Category: Diode; Manufacturer Part Number: SMBJ5.0A-TR; Digikey Description: TVS DIODE 5V 13.4V SMB; Height: 2.65mm; Temperature Range High: +150°C; Octopart: https://octopart.com/smbj5.0a-tr-stmicroelectronics-347079; Device Class L2: TVS Diodes; ComponentLink2Description: Datasheet; Temperature: -55°C to +150°C
J2 J3 = CMP-196119-000001-1: CONN RCPT USB2.0 TYPEC 16POS; Manufacturer: Global Connector Technology; Voltage Rating: 20V; Conn Orientation: Right Angle; Shielding: true; Current Rating: 4.25A; Number Of Contacts: 16; Pitch: 0.85mm; Is Female: yes; ComponentLink2URL: https://gct.co/files/drawings/usb4085.pdf; Category: Conn; Automotive: No; ComponentLink2Description: Datasheet; Height: 3.66mm; Manufacturer Part Number: USB4085-GF-A; Package: 0; Usb Standard: USB 2.0; Octopart: https://octopart.com/usb4085-gf-a-global+connector+technology-94773699; Device Class L3: unset; Digikey Description: CONN RCPT USB2.0 TYPEC 16POS; Temperature Range Low: -40°C; Temperature: -40°C to +85°C; Lead Free: Yes; Contact Material: Gold,Nickel; Device Class L1: Connectors; Temperature Range High: +85°C; Device Class L2: USB Connectors; RoHS: TRUE
LED1 = CMP-1426-00010-1: SMD mono-color Chip LED, WL-SMCW, Super Red; Manufacturer: Wuerth Elektronik; PartNumber: 150080SS75000; PackageReference: 0805_A; ComponentLink2URL: http://katalog.we-online.com/led/datasheet/150080SS75000.pdf; ComponentLink1URL: http://www.we-online.com; Color: Super Red; ComponentLink2Description: Datasheet; ComponentLink1Description: Manufacturer URL
LED2 = CMP-1426-00007-1: SMD mono-color Chip LED, WL-SMCW, Green; PartNumber: 150080GS75000; Manufacturer: Wuerth Elektronik; PackageReference: 0805_A; Color: Green; ComponentLink2URL: http://katalog.we-online.com/led/datasheet/150080GS75000.pdf; ComponentLink1URL: http://www.we-online.com; ComponentLink1Description: Manufacturer URL; ComponentLink2Description: Datasheet
R1 = CMP-1659-00013-4: RC0805FR-0710KL Chip Resistor, 10 KOhm, +/- 1%, 0.125 W, -55 to 155 degC, 0805 (2012 Metric), RoHS, Tape and Reel; Manufacturer: Yageo; Voltage Rating: 150 V; Mount: Surface Mount; ComponentLink1Description: Manufacturer URL; ComponentLink2URL: http://www.yageo.com/documents/recent/PYu-RC_Group_51_RoHS_L_04.pdf; Pins: 2; Length: 2 mm; Min Operating Temperature: -55 degC; Height: 0.5 mm; Mounting Technology: Surface Mount; RoHSCompliant: true; REACH SVHC: No SVHC; ComponentLink1URL: http://www.yageo.com/; Max Operating Temperature: 155 degC; PackageReference: 0805; DatasheetVersion: Rev. 4, 02/2016; Package Quantity: 5000; Packaging: Tape and Reel; ComponentLink2Description: Datasheet; PackageDescription: 2-Pin Surface Mounted Device, Body 2 x 1.25 mm
R2 R4 R6 R7 = CMP-2001-04024-2: RES Thick Film, 5.1kΩ, 1%, 0.125W, 100ppm/°C, 0805 CRCW08055K10FKEA; Power Rating: 125mW; Voltage Rating (DC): 150V; Packaging: Tape and Reel; Case Code (Metric): 2012; Contact Plating: Tin; Case Code (Imperial): 0805; Depth: 1.25mm; Tolerance: 1%; Width: 0.049inch; Temperature Coefficient: 100ppm/°C; Max Power Dissipation: 125mW; Resistance: 5.1kR; Military Standard: Not; Lead Free: Lead Free; Mount: Surface Mount; Min Operating Temperature: -55°C; Package Quantity: 10; Weight: 0.000194oz; Height: 0.45mm; Number of Terminations: 2; Max Operating Temperature: 155°C; Termination: SMD/SMT; Case/Package: 0805; Composition: Thick Film; Voltage Rating: 150V; Length: 2mm; Features: Automotive AEC-Q200; Radiation Hardening: No
R3 R8 = CMP-2100-03671-1: RC0805FR-071KL Chip Resistor, 1 KOhm, +/- 1%, 125 mW, -55 to 155 degC, 0805 (2012 Metric), RoHS, Tape and Reel; Manufacturer: Yageo; Temperature Coefficient: 100ppm/degreesC; Voltage Rating (DC): 150V; Max Power Dissipation: 125mW; Resistance: 1KOhm; Number of Pins: 2; Number of Terminations: 2; Datasheet URL: http://www.yageo.com/NewPortal/yageodocoutput?fileName=/pdf/R-Chip/PYu-RC_Group_51_RoHS_L_5.pdf; Length: 0.079inch; Package Description: 2-Pin Surface Mounted Device, Body 2 x 1.25 mm; Depth: 1.25mm; Height: 0.024inch; Military Standard: Not; Case/Package: 0805; Package Reference: 0805; RoHSCompliant: true; Lead Free: LeadFree; Packaging: TapeandReel; Package Quantity: 1; Datasheet Version: Rev. 5, 10/2016; Tolerance: 1%; Min Operating Temperature: -55degC; Voltage Rating: 150V; Composition: ThickFilm; Case Code (Imperial): 0805; Power Rating: 125mW; Width: 0.049inch; Case Code (Metric): 2012; Manufacturer URL: http://www.yageo.com/; Max Operating Temperature: 155degC; REACH SVHC: Unknown; Termination: SMD/SMT
R5 = CMP-2100-03681-2: RC1206JR-070RL RES SMD 0 OHM JUMPER 1/4W 1206; Manufacturer: YAGEO; Voltage Rating: 200V; Temperature Coefficient: 300ppm/°C; Power Rating: 0.25W; Value: 0Ω; Tolerance: 5%; Manufacturer Part Number: RC1206JR-070RL; Temperature Range Low: -55°C; Category: Res; Automotive: No; Ipc Land Pattern Name: RESC310160X55; Device Class L1: Passive Components; Temperature: -55°C to +155°C; ComponentLink2URL: https://www.yageo.com/upload/media/product/productsearch/datasheet/rchip/PYu-RC_Group_51_RoHS_L_10.pdf; Lead Free: Yes; Height: 0.65mm; Footprint Url: https://www.yageo.com/upload/website/yageo_PYu-R_Mount_10_19050818_343.pdf; Package: RC1206; Digikey Description: RES SMD 0 OHM JUMPER 1/4W 1206; Temperature Range High: +155°C; Device Class L3: Chip SMD Resistors; Device Class L2: Resistors; Octopart: https://octopart.com/rc1206jr-070rl-yageo-40025601; Resistance: 0Ω; Series: RC; ComponentLink2Description: Datasheet; Composition: Thick Film; RoHS: TRUE; Mouser Description: Resistor: thick film; SMD; 1206; 0O; 0.25W; ±5%; -55÷155°C
S1 = KTS1681AEUZ-TR: Switch; Manufacturer_Name: Kinetic Technologies; Height: 0.665mm; Manufacturer_Part_Number: KTS1681AEUZ-TR
U1 = CMP-0244-00363-1: Ultra Low Drop Low Noise BiCMOS 300 mA Voltage Regulator for use with Very Low ESR Output Capacitor, 3.3V, 5-Pin SOT-23, Tape and Reel; ComponentLink2Description: Datasheet; ComponentLink2URL: http://www.st.com/internet/com/TECHNICAL_RESOURCES/TECHNICAL_LITERATURE/DATASHEET/CD00047465.pdf; PackageDescription: 5-Pin SOT-23 Package, 2.9 x 1.6 mm Body, 0.95 mm Pitch, 2.8 mm Lead Span; ComponentLink1Description: Manufacturer URL; ComponentLink1URL: http://www.st.com; DatasheetVersion: 1/07/2010; PackageVersion: 1/01/2008; PackageReference: SOT23-5L

## Sheet Peripherals - USB.SchDoc
size A; SheetNumber: 4; SheetTotal: 6
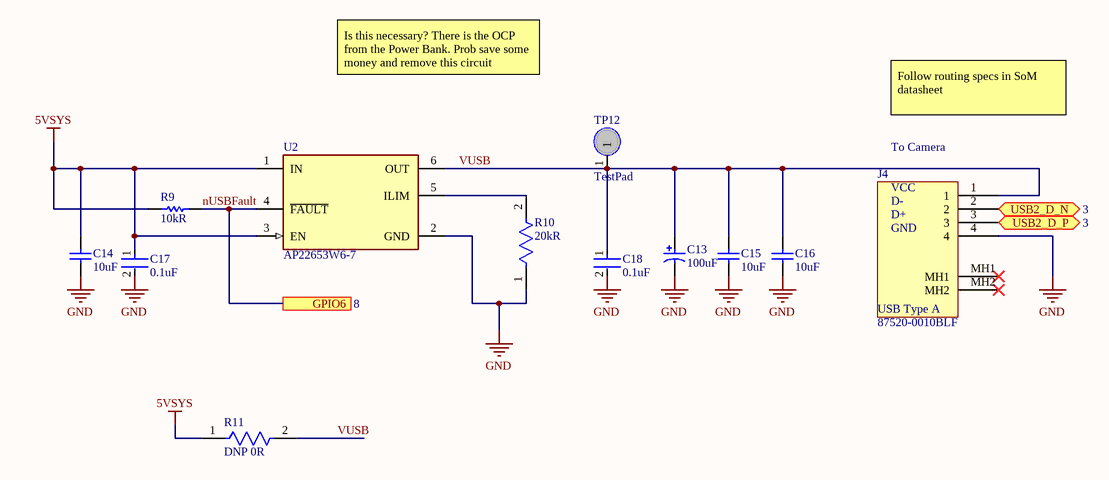
[diagram p3: Peripherals - USB.SchDoc]

### Parts
C13  100uF  [PNSC-EEEFK1C101P_L]
C14  10uF  [CAPC2013X145X20ML20]
C15  10uF  [CAPC2013X145X20ML20]
C16  10uF  [CAPC2013X145X20ML20]
C17  0.1uF  [FP-C0603-CJ-MFG]
C18  0.1uF  [FP-C0603-CJ-MFG]
J4  87520-0010BLF  [875200010BLF]
R9  10kR  [RESC2013X60X35NL10T20]
R10  20kR  [FP-CRCW0805-e3-MFG]
R11  DNP 0R  [FP-RC1206-MFG]
TP12  TestPad  [TestPad50mil]
U2  AP22653W6-7  [FP-SOT26-MFG]

### Ports
GPIO6 (see 8), USB2_D_N (bidir, see 3), USB2_D_P (bidir, see 3)

### Nets
5VSYS: C14.2 C17.1 R9.2 R11.1 U2.1(IN) U2.3(EN)
GND: C13.2 C14.1 C15.1 C16.1 C17.2 C18.2 J4.4 R10.1 U2.2(GND)
nUSBFault: R9.1 U2.4(~{FAULT}) ; port GPIO6  [project net GPIO6]
VUSB: C13.1 C15.2 C16.2 C18.1 J4.1 R11.2 TP12.1 U2.6(OUT)
NetJ4_2: J4.2 ; port USB2_D_N
NetJ4_3: J4.3 ; port USB2_D_P
NetR10_2: R10.2 U2.5(ILIM)

Not connected (* = marked no-connect by the designer): J4 MH1* MH2*

### Notes on the sheet
- Is this necessary? There is the OCP from the Power Bank. Prob save some money and remove this circuit
- Follow routing specs in SoM datasheet
- (near J4) To Camera
- (in symbol 87520-0010BLF) VCC; D-; D+; GND; USB Type A

### Library data of the parts
C13 = CMP-2000-06203-1: EEEFK1C101P Aluminum Electrolytic Capacitor, 100 uF, 20%, 16 V, -55 to 105 degC, 2-Pin SMD, RoHS, Tape and Reel; Manufacturer: Panasonic; Lifetime@Temperature: 2000Hrs@105°C; Impedance: 0.36O; Ripple Current: 240mA; Rated Voltage: 16V; Type: Can; Capacitance: 100µF; Datasheet URL: http://datasheet.octopart.com/EEEFK1C101P-Panasonic-datasheet-13266987.pdf; Package Description: 2-Pin Surface Mount Device, Body 6.6 x 6.6 mm; Manufacturer URL: http://www.panasonic.com/; Case Size/Dimension: Ø6.3x5.8mm; Series: FK; Datasheet Version: 11/2012; Mounting Technology: SurfaceMount; Package Reference: EEEFK1C101P; Operating Temp-Max: 105°C; Operating Temp Range: -55to+105°C
C14-C16 = CMP-2000-05452-1: as C12 on sheet Power; Features: -; Ratings: -; Operating Temperature: -55degC~125degC; RoHS Information: RoHSCertificate-MLCC; Datasheet Version: Mar-15; Package / Case: 0805(2012Metric); Series: C; Mounting Type: SurfaceMount,MLCC; Family: CeramicCapacitors; Height - Seated (Max): -; Manufacturer URL: http://www.tdk.com/; Packaging: Digi-Reel; Tolerance: ±10%; Category: Capacitors; Applications: GeneralPurpose; Standard Package: 1; Size / Dimension: 0.079"Lx0.049"W(2.00mmx1.25mm); Datasheet URL: http://download.siliconexpert.com/pdfs/2015/4/21/15/54/45/779/tdk_/manual/37024850441143360mlcc_commercial_general_en.pdf; Lead Style: -; Lead Spacing: -; Thickness (Max): 0.057"(1.45mm); Package Reference: 805; Package Description: 2-Pin Surface Mount Device, Body 2 x 1.25 mm
C17 C18 = CMP-2006-03300-2: as C1 on sheet SoM; Temperature Range High: +125°C; Temperature Range Low: -55°C; Manufacturer Part Number: C0603X104K5RACTU; Voltage: 50V; ComponentLink2Description: Datasheet; RoHS: TRUE; ComponentLink2URL: https://content.kemet.com/datasheets/KEM_C1013_X7R_FT-CAP_SMD.pdf; Device Class L3: Ceramic Capacitors; Device Class L2: Capacitors; Package: C0603-CJ; Height: 0.95mm; Device Class L1: Passive Components; Temperature Characteristic: X7R; Lead Free: Yes; Digikey Description: CAP CER 0.1UF 50V X7R 0603; Automotive: No; Mouser Description: Capacitor; Ceramic; Cap 0.1uF; Tol+10%; SMT; Flexible Termination; Vol-Rtg 50V; TR; Temperature: -55°C to +125°C; Octopart: https://octopart.com/c0603x104k5ractu-kemet-9145062; Category: Cap; Voltage Rating: 50V; Ipc Land Pattern Name: CAPC16080X80
R9 = CMP-1659-00013-4: as R1 on sheet Power; Mount: Surface Mount; ComponentLink1Description: Manufacturer URL; ComponentLink2URL: http://www.yageo.com/documents/recent/PYu-RC_Group_51_RoHS_L_04.pdf; Pins: 2; Length: 2 mm; Min Operating Temperature: -55 degC; Height: 0.5 mm; Mounting Technology: Surface Mount; RoHSCompliant: true; REACH SVHC: No SVHC; ComponentLink1URL: http://www.yageo.com/; Max Operating Temperature: 155 degC; PackageReference: 0805; DatasheetVersion: Rev. 4, 02/2016; Package Quantity: 5000; Packaging: Tape and Reel; ComponentLink2Description: Datasheet; PackageDescription: 2-Pin Surface Mounted Device, Body 2 x 1.25 mm
R10 = CMP-2001-03667-2: RES Thick Film, 20kΩ, 1%, 0.125W, 100ppm/°C, 0805; Power Rating: 125mW; Voltage Rating (DC): 150V; Number of Pins: 2; Termination: SMD/SMT; Number of Terminations: 2; Case Code (Metric): 2012; Depth: 1.25mm; Packaging: Tape and Reel; Case Code (Imperial): 0805; Lead Free: Lead Free; Voltage Rating: 150V; Resistance: 20kR; Tolerance: 1%; Max Power Dissipation: 125mW; Composition: Thick Film; Height: 0.45mm; Weight: 0.000194oz; Working Voltage: 150V; Length: 2mm; Temperature Coefficient: 100ppm/°C; Mount: Surface Mount; Min Operating Temperature: -55°C; Features: Automotive AEC-Q200; Military Standard: Not; Contact Plating: Tin; Max Operating Temperature: 155°C; Case/Package: 0805; Package Quantity: 10; Width: 1.25mm
R11 = CMP-2100-03681-2: RC1206JR-070RL RES SMD 0 OHM JUMPER 1/4W 1206; Manufacturer: YAGEO; Voltage Rating: 200V; Temperature Coefficient: 300ppm/°C; Power Rating: 0.25W; Value: 0Ω; Description: 0 Ohms Jumper 0.25W, 1/4W Chip Resistor 1206 (3216 Metric) Moisture Resistant Thick Film; Tolerance: 5%; Manufacturer Part Number: RC1206JR-070RL; Temperature Range Low: -55°C; Category: Res; Automotive: No; Ipc Land Pattern Name: RESC310160X55; Device Class L1: Passive Components; Temperature: -55°C to +155°C; ComponentLink2URL: https://www.yageo.com/upload/media/product/productsearch/datasheet/rchip/PYu-RC_Group_51_RoHS_L_10.pdf; Lead Free: Yes; Height: 0.65mm; Footprint Url: https://www.yageo.com/upload/website/yageo_PYu-R_Mount_10_19050818_343.pdf; Package: RC1206; Digikey Description: RES SMD 0 OHM JUMPER 1/4W 1206; Temperature Range High: +155°C; Device Class L3: Chip SMD Resistors; Device Class L2: Resistors; Octopart: https://octopart.com/rc1206jr-070rl-yageo-40025601; Resistance: 0Ω; Series: RC; ComponentLink2Description: Datasheet; Composition: Thick Film; RoHS: TRUE; Mouser Description: Resistor: thick film; SMD; 1206; 0O; 0.25W; ±5%; -55÷155°C
U2 = CMP-12749-000002-1: LOAD SWITCH,SOT26,T&R,3K

## Sheet Peripherals - MyoSensor.SchDoc
size 420 x 297 mm; SheetNumber: 5; SheetTotal: 6
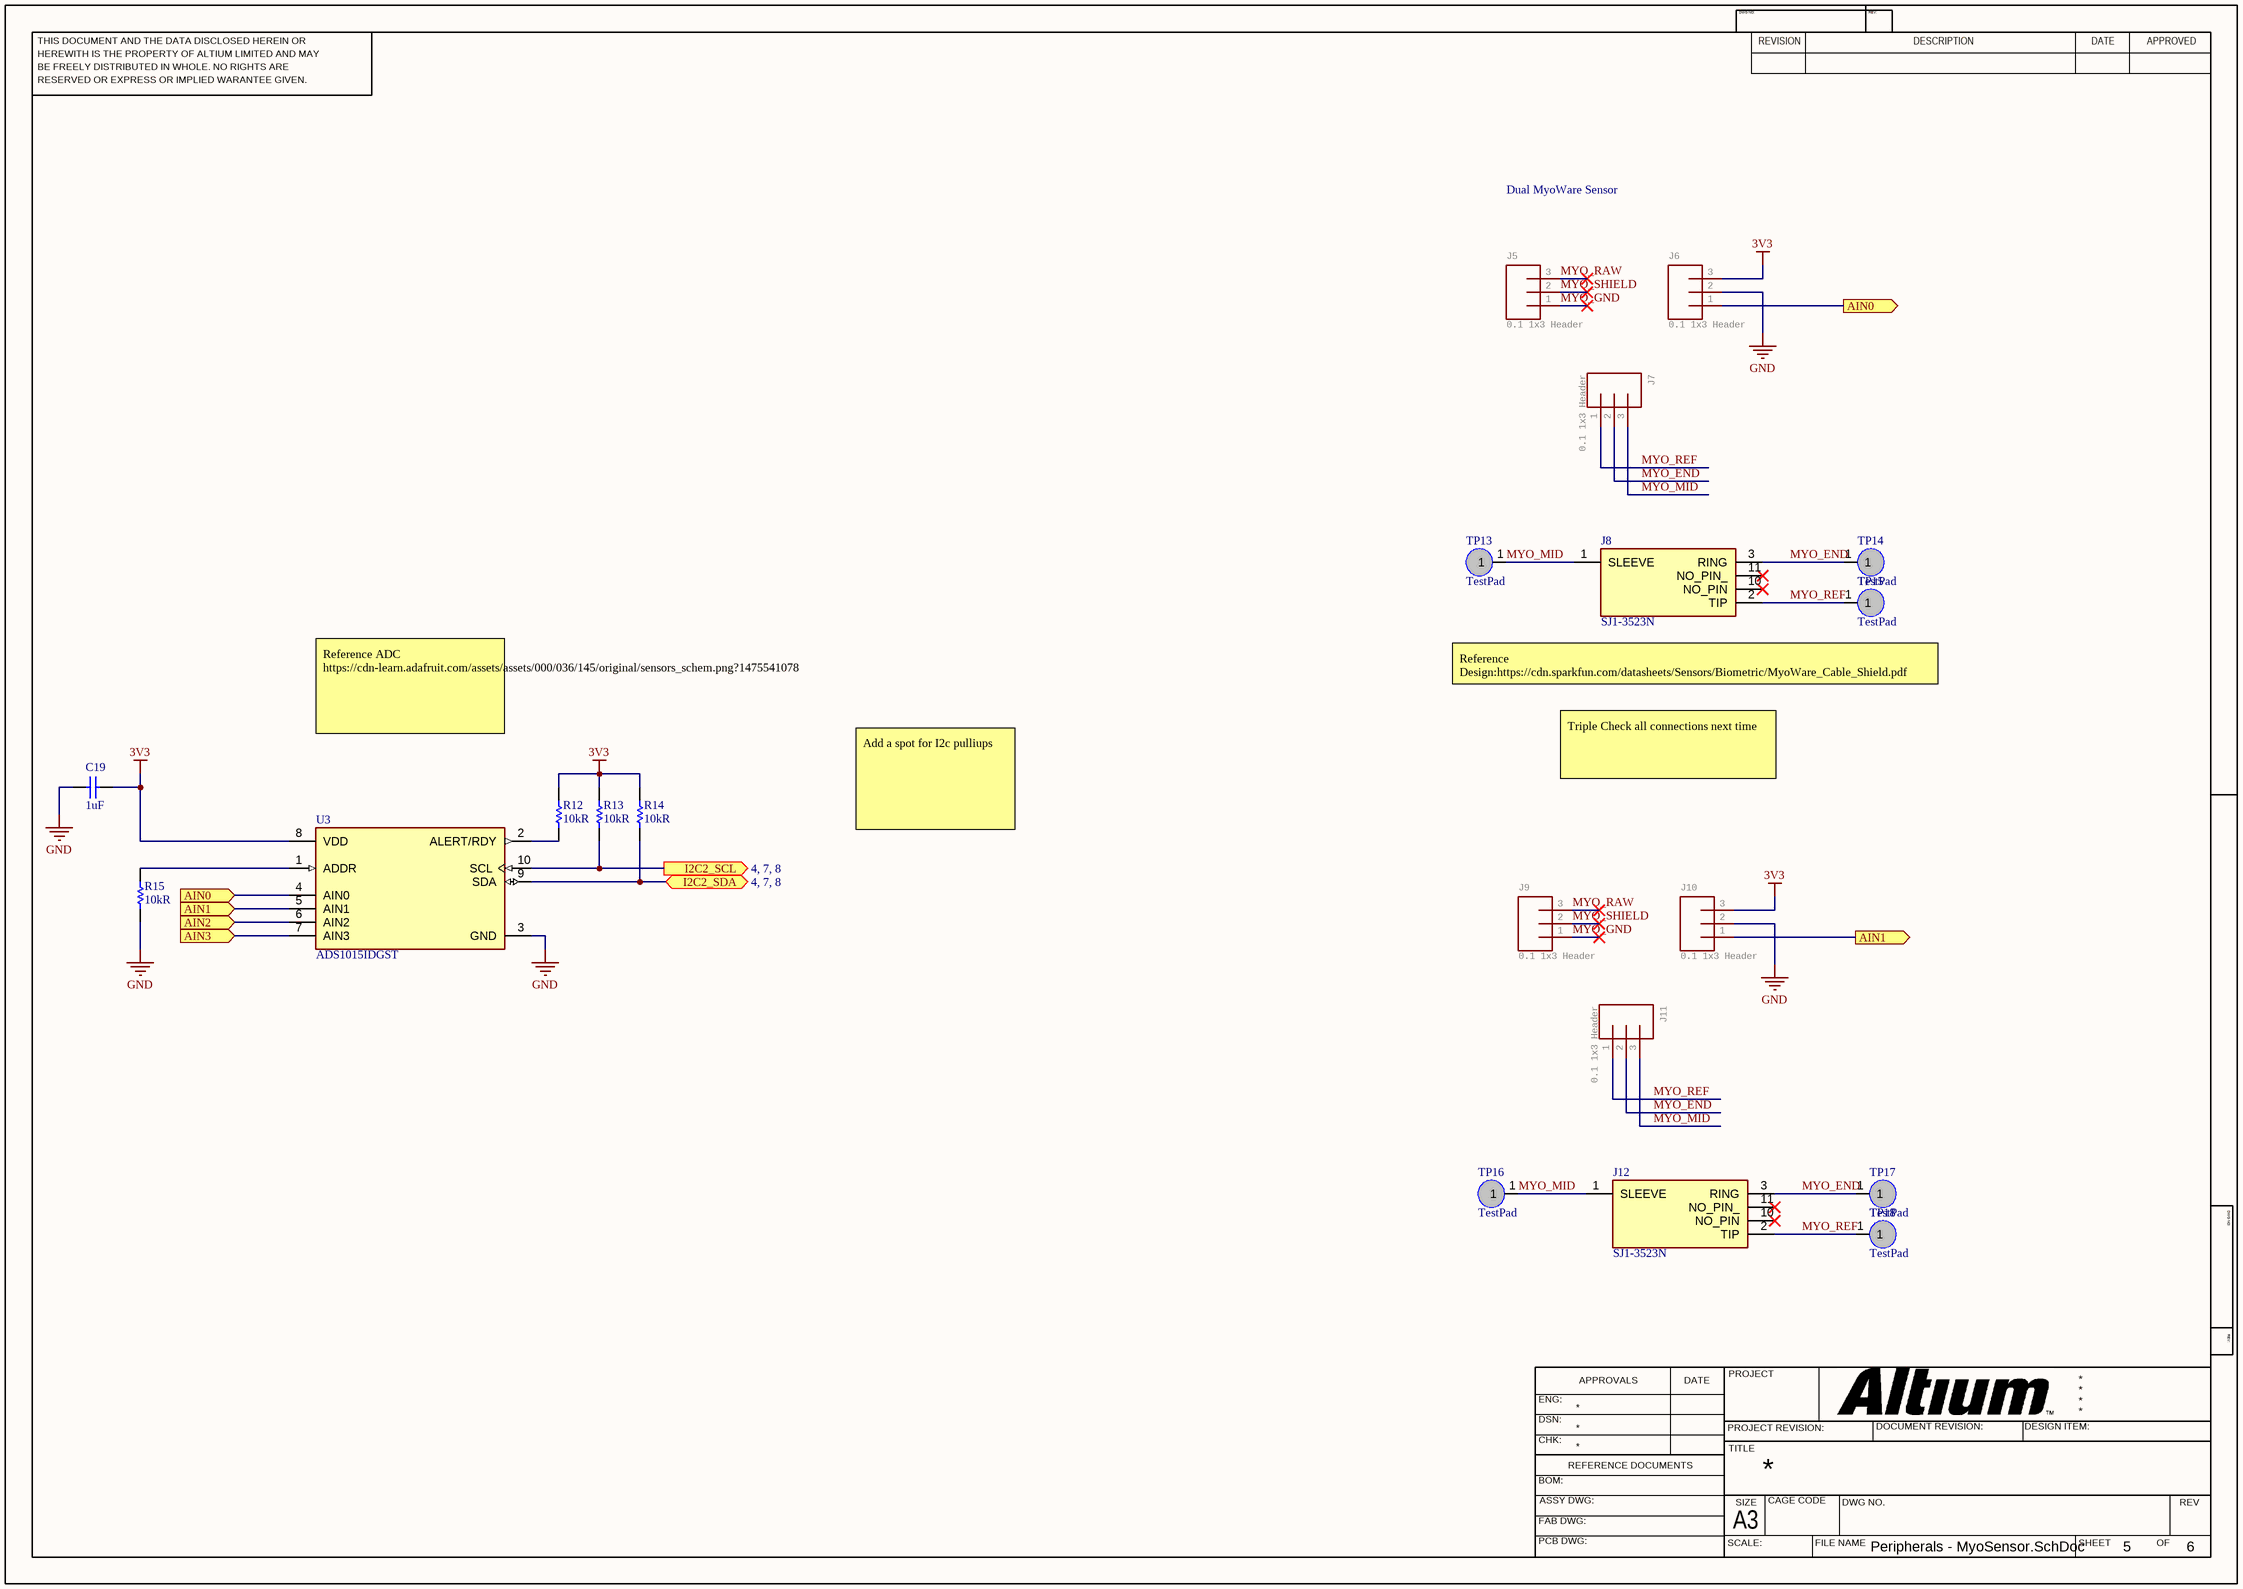
[diagram p4: Peripherals - MyoSensor.SchDoc]

### Parts
C19  1uF  [CAPC2013X145X50LL20T25]
J5  0.1 1x3 Header  [1X03]
J6  0.1 1x3 Header  [1X03]
J7  0.1 1x3 Header  [1X03]
J8  SJ1-3523N  [SJ13523N]
J9  0.1 1x3 Header  [1X03]
J10  0.1 1x3 Header  [1X03]
J11  0.1 1x3 Header  [1X03]
J12  SJ1-3523N  [SJ13523N]
R12  10kR  [RESC2013X60X35NL10T20]
R13  10kR  [RESC2013X60X35NL10T20]
R14  10kR  [RESC2013X60X35NL10T20]
R15  10kR  [RESC2013X60X35NL10T20]
TP13  TestPad  [TestPad50mil]
TP14  TestPad  [TestPad50mil]
TP15  TestPad  [TestPad50mil]
TP16  TestPad  [TestPad50mil]
TP17  TestPad  [TestPad50mil]
TP18  TestPad  [TestPad50mil]
U3  ADS1015IDGST  [FP-DGS0010A-MFG]

### Ports
AIN0 (in), AIN0 (out), AIN1 (in), AIN1 (out), AIN2 (in), AIN3 (in), I2C2_SCL (out, see 4, 7, 8), I2C2_SDA (bidir, see 4, 7, 8)

### Nets
3V3: C19.2 J6.3 J10.3 R12.2 R13.2 R14.2 U3.8(VDD)
GND: C19.1 J6.2 J10.2 R15.1 U3.3(GND)
I2C2_SCL: R13.1 U3.10(SCL) ; port I2C2_SCL
I2C2_SDA: R14.1 U3.9(SDA) ; port I2C2_SDA
MYO_END: J7.2 J8.3(RING) J11.2 J12.3(RING) TP14.1 TP17.1
MYO_GND: J5.1 J9.1
MYO_MID: J7.3 J8.1(SLEEVE) J11.3 J12.1(SLEEVE) TP13.1 TP16.1
MYO_RAW: J5.3 J9.3
MYO_REF: J7.1 J8.2(TIP) J11.1 J12.2(TIP) TP15.1 TP18.1
MYO_SHIELD: J5.2 J9.2
NetJ6_1: J6.1 U3.4(AIN0) ; port AIN0
NetJ10_1: J10.1 U3.5(AIN1) ; port AIN1
NetR12_1: R12.1 U3.2(ALERT/RDY)
NetR15_2: R15.2 U3.1(ADDR)
NetU3_6: U3.6(AIN2) ; port AIN2
NetU3_7: U3.7(AIN3) ; port AIN3

Not connected (* = marked no-connect by the designer): J8 10(NO_PIN)* 11(NO_PIN_)*; J12 10(NO_PIN)* 11(NO_PIN_)*

### Notes on the sheet
- Dual MyoWare Sensor
- Reference ADC
  https://cdn-learn.adafruit.com/assets/assets/000/036/145/original/sensors_schem.png?1475541078
- Reference Design:https://cdn.sparkfun.com/datasheets/Sensors/Biometric/MyoWare_Cable_Shield.pdf
- Triple Check all connections next time
- Add a spot for I2c pulliups
- THIS DOCUMENT AND THE DATA DISCLOSED HEREIN OR
- HEREWITH IS THE PROPERTY OF ALTIUM LIMITED AND MAY
- DWG NO:
- REVISION
- REV:
- DESCRIPTION
- DATE
- APPROVED
- BE FREELY DISTRIBUTED IN WHOLE. NO RIGHTS ARE
- RESERVED OR EXPRESS OR IMPLIED WARANTEE GIVEN.
- ENG:
- APPROVALS
- PROJECT
- DSN:
- CHK:
- REFERENCE DOCUMENTS
- PROJECT REVISION:
- TITLE
- DOCUMENT REVISION:
- DESIGN ITEM:
- BOM:
- FAB DWG:
- PCB DWG:
- ASSY DWG:
- SCALE:
- A3
- SIZE
- CAGE CODE
- FILE NAME
- DWG NO.
- SHEET
- OF
- REV

### Library data of the parts
C19 = CMP-1036-04746-2: C0805C105K4PACTU; Manufacturer: Kemet; Part Number: C0805C105K4PACTU
J5-J7 J9-J11 = CONN_03: GateName_1: J$1; PROD_ID: XXX-00000; SymbolName_1: CONN_03; LibraryName: SparkFun-Connectors; DeviceSetName: CONN_03; Package: 1X03
J8 J12 = SJ1-3523N: Connector; Manufacturer_Name: CUI Inc.; Datasheet Link: https://componentsearchengine.com/Datasheets/1/SJ1-3523N.pdf; Height: 5.5mm; Manufacturer_Part_Number: SJ1-3523N; Mouser Part Number: 490-SJ1-3523N; Mouser Price/Stock: https://www.mouser.co.uk/ProductDetail/CUI-Devices/SJ1-3523N?qs=WyjlAZoYn50aNl0vAhb3Tg%3D%3D; Arrow Part Number: SJ1-3523N; Arrow Price/Stock: https://www.arrow.com/en/products/sj1-3523n/cui-devices
R12-R15 = CMP-1659-00013-4: as R1 on sheet Power; Mount: Surface Mount; ComponentLink1Description: Manufacturer URL; ComponentLink2URL: http://www.yageo.com/documents/recent/PYu-RC_Group_51_RoHS_L_04.pdf; Pins: 2; Length: 2 mm; Min Operating Temperature: -55 degC; Height: 0.5 mm; Mounting Technology: Surface Mount; RoHSCompliant: true; REACH SVHC: No SVHC; ComponentLink1URL: http://www.yageo.com/; Max Operating Temperature: 155 degC; PackageReference: 0805; DatasheetVersion: Rev. 4, 02/2016; Package Quantity: 5000; Packaging: Tape and Reel; ComponentLink2Description: Datasheet; PackageDescription: 2-Pin Surface Mounted Device, Body 2 x 1.25 mm
U3 = CMP-0003-00377-3: IC ADC 12BIT SIGMA-DELTA 10VSSOP; Supply Type: Single; Number of Converters: 1; Number of Bits: 12; Number of Inputs: 4; Sampling Rate: 3.3KS/s; Conversion Rate: 3300S/s; Min Supply Voltage: 2V; Interface: I2C; Operating Supply Voltage: 3.3V; Polarity: Bipolar; Nominal Supply Current: 150uA; Integral Nonlinearity (INL): 0.5LSB; Max Power Dissipation: 900uW; Max Supply Voltage (DC): 5.5V; Resolution: 12b; Width: 3mm; Min Operating Temperature: -40°C; Contact Plating: Gold; Number of A/D Converters: 1; Max Operating Temperature: 125°C; Height: 1.02mm; Case/Package: VSSOP; Package Quantity: 250; Number of Elements: 1; Lead Free: Lead Free; Number of Pins: 10; Radiation Hardening: No; Termination: SMD/SMT; Length: 3mm; Min Supply Voltage (DC): 2V; Power Dissipation: 900uW; Number of Channels: 4; Max Supply Voltage: 5.5V; REACH SVHC: No SVHC; Packaging: Tape and Reel

## Sheet Peripherals - Servos.SchDoc
size 420 x 297 mm; SheetNumber: 6; SheetTotal: 6
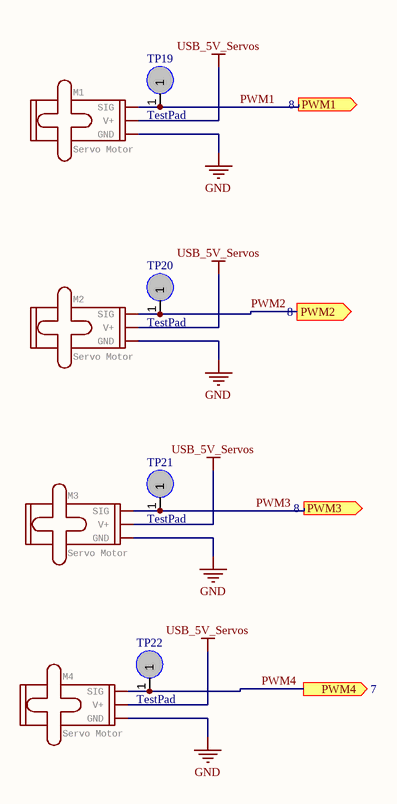
[diagram p5: Peripherals - Servos.SchDoc]

### Parts
M1  Servo Motor  [1X03]
M2  Servo Motor  [1X03]
M3  Servo Motor  [1X03]
M4  Servo Motor  [1X03]
TP19  TestPad  [TestPad50mil]
TP20  TestPad  [TestPad50mil]
TP21  TestPad  [TestPad50mil]
TP22  TestPad  [TestPad50mil]

### Ports
PWM1 (out, see 8), PWM2 (out, see 8), PWM3 (out, see 8), PWM4 (out, see 7)

### Nets
GND: M1.3(GND) M2.3(GND) M3.3(GND) M4.3(GND)
USB_5V_Servos: M1.2(V+) M2.2(V+) M3.2(V+) M4.2(V+)
PWM1: M1.1(SIG) TP19.1 ; port PWM1
PWM2: M2.1(SIG) TP20.1 ; port PWM2
PWM3: M3.1(SIG) TP21.1 ; port PWM3
PWM4: M4.1(SIG) TP22.1 ; port PWM4

### Notes on the sheet
- THIS DOCUMENT AND THE DATA DISCLOSED HEREIN OR
- HEREWITH IS THE PROPERTY OF ALTIUM LIMITED AND MAY
- DWG NO:
- REVISION
- REV:
- DESCRIPTION
- DATE
- APPROVED
- BE FREELY DISTRIBUTED IN WHOLE. NO RIGHTS ARE
- RESERVED OR EXPRESS OR IMPLIED WARANTEE GIVEN.
- ENG:
- APPROVALS
- PROJECT
- DSN:
- CHK:
- REFERENCE DOCUMENTS
- PROJECT REVISION:
- TITLE
- DOCUMENT REVISION:
- DESIGN ITEM:
- BOM:
- FAB DWG:
- PCB DWG:
- ASSY DWG:
- SCALE:
- A3
- SIZE
- CAGE CODE
- FILE NAME
- DWG NO.
- SHEET
- OF
- REV

### Library data of the parts
M1-M4 = SERVO: GateName_1: G$1; SymbolName_1: SMALL_SERVO_MOTOR; LibraryName: SparkFun-Electromechanical; DeviceSetName: SERVO; Package: 1X03

## Nets that join several sheets
3V3: SoM (J1.1 J1.17), Power (C10.2 TP7.1 U1.5), Peripherals - MyoSensor (7 pins)
5VSYS: SoM (10 pins), Power (12 pins), Peripherals - USB (6 pins)
GND: SoM (82 pins), Power (32 pins), Peripherals - USB (9 pins), Peripherals - MyoSensor (5 pins), Peripherals - Servos (M1.3 M2.3 M3.3 M4.3)
USB_5V_Servos: Power (8 pins), Peripherals - Servos (M1.2 M2.2 M3.2 M4.2)
GPIO6: SoM (J1.13 J1312.49), Peripherals - USB (R9.1 U2.4)
I2C2_SCL: SoM (J1.5 J1311.87), Peripherals - MyoSensor (R13.1 U3.10)
I2C2_SDA: SoM (J1.3 J1311.85), Peripherals - MyoSensor (R14.1 U3.9)
NetJ4_2: SoM (J1311.65), Peripherals - USB (J4.2)
NetJ4_3: SoM (J1311.63), Peripherals - USB (J4.3)
PWM1: SoM (J1.32 J1312.88), Peripherals - Servos (M1.1 TP19.1)
PWM2: SoM (J1.33 J1312.90), Peripherals - Servos (M2.1 TP20.1)
PWM3: SoM (J1.15 J1312.92), Peripherals - Servos (M3.1 TP21.1)
PWM4: SoM (J1312.11), Peripherals - Servos (M4.1 TP22.1)